# EAGLE schematic brd-relays3-draft2 (EAGLE 6.5.0)
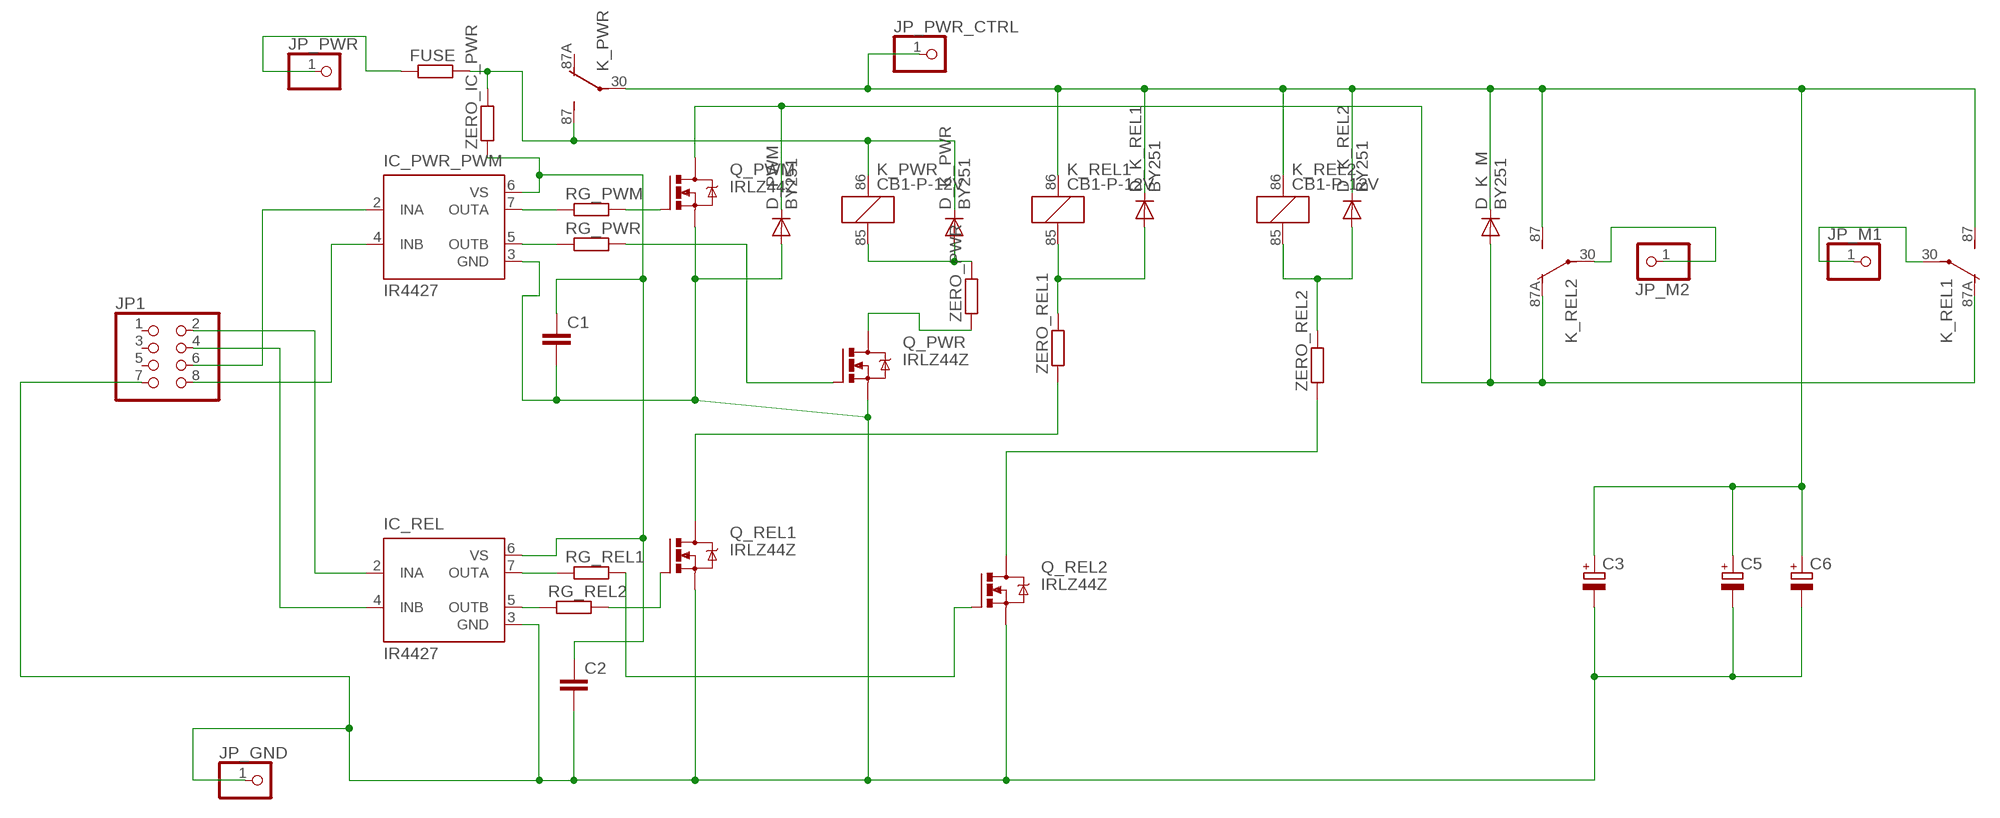
[diagram p0: schematic, sheet 1]

## Parts
C1  C-EU050-055X075  [C050-055X075]
C2  C-EU050-055X075  [C050-055X075]
C3  CPOL-EUE5-13  [E5-13]
C5  CPOL-EUE5-13  [E5-13]
C6  CPOL-EUE5-13  [E5-13]
D_K_M  BY251  [DO201-15]
D_K_PWR  BY251  [DO201-15]
D_K_REL1  BY251  [DO201-15]
D_K_REL2  BY251  [DO201-15]
D_PWM  BY251  [DO201-15]
FUSE  R-EU_0207/10  [FUSE_PACK1]
IC_PWR_PWM  IR4427  [DIL08]
IC_REL  IR4427  [DIL08]
JP1  PINHD-2X4  [2X04]
JP_GND  PINHD-1X1  [1X01]
JP_M1  PINHD-1X1  [1X01]
JP_M2  PINHD-1X1  [1X01]
JP_PWR  PINHD-1X1  [1X01]
JP_PWR_CTRL  PINHD-1X1  [1X01]
K_PWR  CB1-P-12V  [CB1]
K_REL1  CB1-P-12V  [CB1]
K_REL2  CB1-P-12V  [CB1]
Q_PWM  IRLZ44Z  [TO220BH]
Q_PWR  IRLZ44Z  [TO220BH]
Q_REL1  IRLZ44Z  [TO220BH]
Q_REL2  IRLZ44Z  [TO220BH]
RG_PWM  R-EU_0207/10  [0207/10]
RG_PWR  R-EU_0207/10  [0207/10]
RG_REL1  R-EU_0207/10  [0207/10]
RG_REL2  R-EU_0207/10  [0207/10]
ZERO_IC_PWR  R-EU_0207/10  [0207/10]
ZERO_PWR  R-EU_0207/10  [0207/10]
ZERO_REL1  R-EU_0207/10  [0207/10]
ZERO_REL2  R-EU_0207/10  [0207/10]

## Nets
GND: C1.2 C2.2 C3.- C5.- C6.- D_PWM.A IC_PWR_PWM.3(GND) IC_REL.3(GND) JP1.7 JP_GND.1 Q_PWM.S Q_PWR.S Q_REL1.S Q_REL2.S
N$1: FUSE.1 JP_PWR.1
N$2: JP_M2.1 K_REL2.30(2:P)
N$3: IC_PWR_PWM.7(OUTA) RG_PWM.1
N$4: IC_PWR_PWM.5(OUTB) RG_PWR.1
N$5: Q_PWM.G RG_PWM.2
N$6: Q_PWR.G RG_PWR.2
N$7: IC_REL.7(OUTA) RG_REL1.1
N$8: Q_REL2.G RG_REL1.2
N$9: IC_REL.5(OUTB) RG_REL2.1
N$10: Q_REL1.G RG_REL2.2
N$11: IC_REL.2(INA) JP1.2
N$12: IC_REL.4(INB) JP1.4
N$13: IC_PWR_PWM.2(INA) JP1.6
N$14: D_K_PWR.C FUSE.2 K_PWR.86 K_PWR.87(2:S) ZERO_IC_PWR.2
N$16: D_K_PWR.A K_PWR.85 ZERO_PWR.2
N$17: IC_PWR_PWM.4(INB) JP1.8
N$18: JP_M1.1 K_REL1.30(2:P)
N$19: Q_REL1.D ZERO_REL1.1
N$20: Q_REL2.D ZERO_REL2.1
N$21: Q_PWR.D ZERO_PWR.1
N$22: D_K_M.A D_PWM.C K_REL1.87A(2:O) K_REL2.87A(2:O) Q_PWM.D
N$23: D_K_REL1.A K_REL1.85 ZERO_REL1.2
N$24: C3.+ C5.+ C6.+ D_K_M.C D_K_REL1.C D_K_REL2.C JP_PWR_CTRL.1 K_PWR.30(2:P) K_REL1.86 K_REL1.87(2:S) K_REL2.86 K_REL2.87(2:S)
N$25: D_K_REL2.A K_REL2.85 ZERO_REL2.2
VCC: C1.1 C2.1 IC_PWR_PWM.6(VS) IC_REL.6(VS) ZERO_IC_PWR.1
Unconnected: JP1.1 JP1.3 JP1.5 K_PWR.87A(2:O)

## Library data of the parts
C1 C2 = rcl:C-EU: CAPACITOR, European symbol
C3 C5 C6 = rcl:CPOL-EU: POLARIZED CAPACITOR, European symbol
D_K_M D_K_PWR D_K_REL1 D_K_REL2 D_PWM = diode:BY251: DIODE Si, 200 V, 3 A
FUSE = dbg-misc:R-EU_: RESISTOR, European symbol
IC_PWR_PWM IC_REL = ir:IR4427: DUAL LOW SIDE DRIVER Source: ID4426.pdf; MF: INTERNATIONAL RECTIFIER(IR); MPN: IR4427; OC_FARNELL: 1023267; OC_NEWARK: 27C6914
JP1 = pinhead:PINHD-2X4: PIN HEADER
JP_GND JP_M1 JP_M2 JP_PWR JP_PWR_CTRL = dbg-misc:PINHD-1X1: PIN HEADER
K_PWR K_REL1 K_REL2 = dbg-misc:CB1*: HIGH POWER AUTOMOTIVE RELAY Form C NAiS Source: http://www.mew-europe.com/.. en_ds_61202_0000.pdf; MF: AROMAT/ MATSUSHITA; MPN: CB1-P-12V; OC_FARNELL: unknown; OC_NEWARK: 52F9201
Q_PWM Q_PWR Q_REL1 Q_REL2 = dbg-misc:IRLZ44Z: N-Channel HEXFET® Power MOSFET Logic Level AUTOMOTIVE MOSFET Source: http://www.irf.com/product-info/datasheets/data/irlz44zpbf.pdf
RG_PWM RG_PWR RG_REL1 RG_REL2 ZERO_IC_PWR ZERO_PWR ZERO_REL1 ZERO_REL2 = rcl:R-EU_: RESISTOR, European symbol